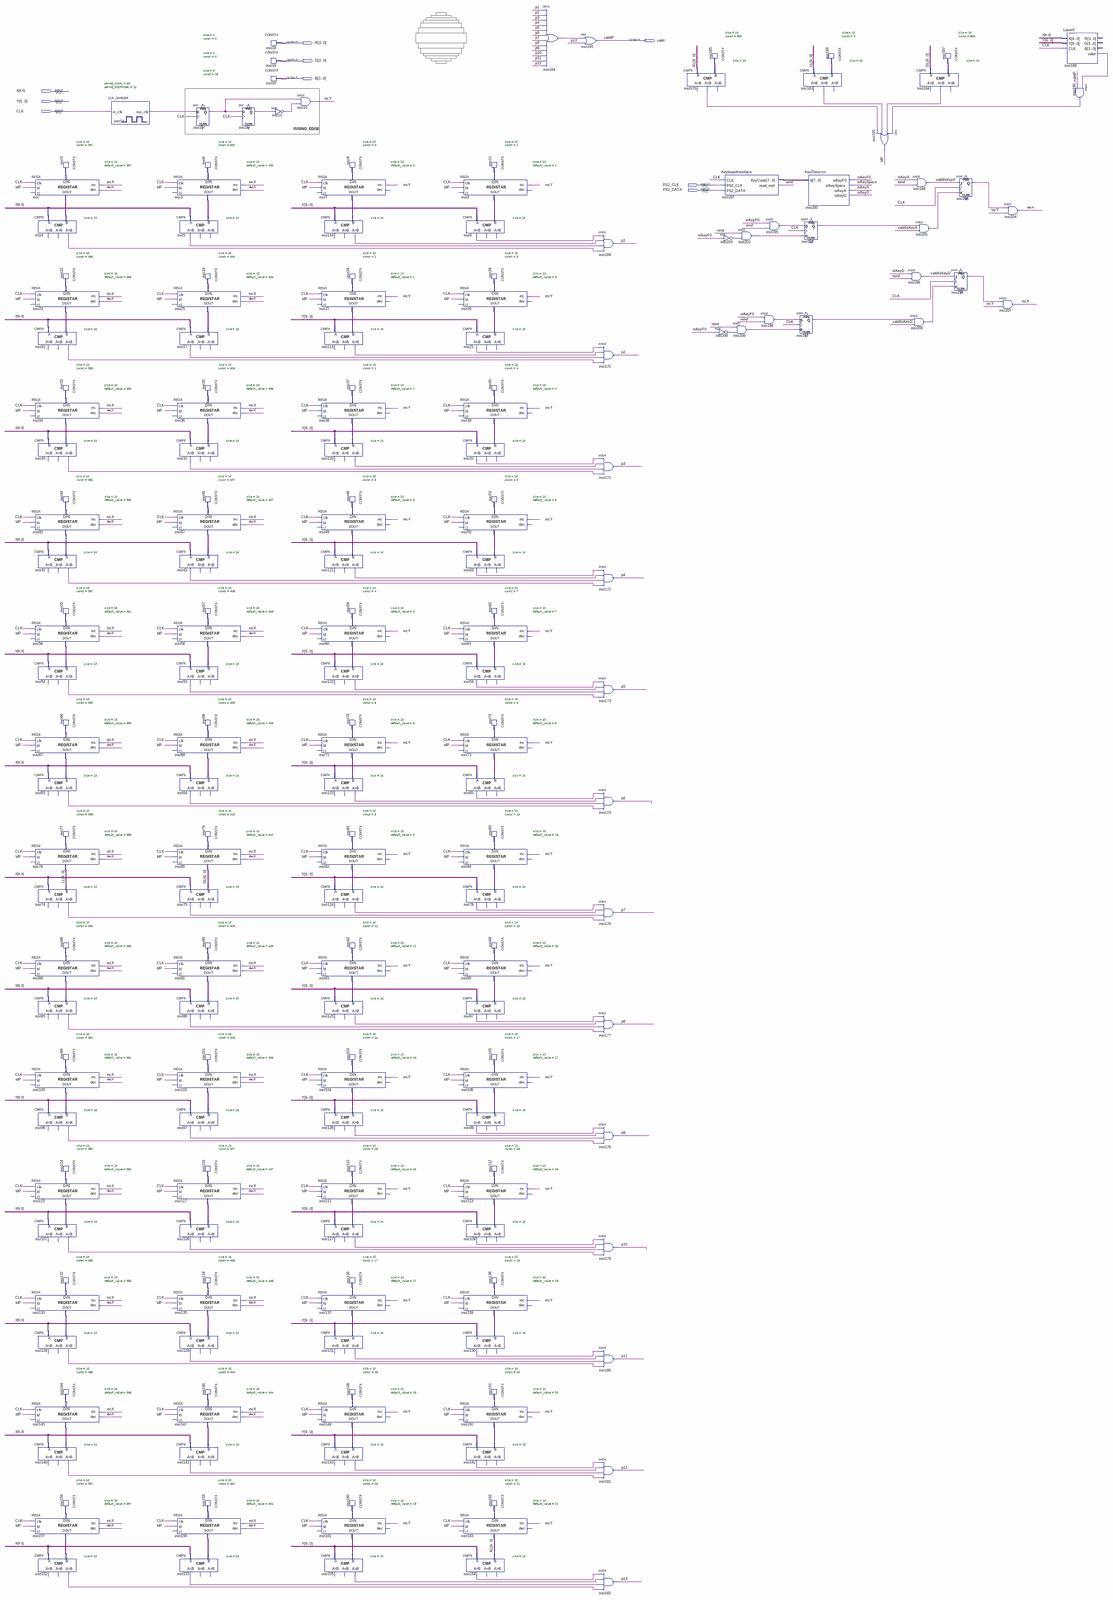
[diagram p0: schematic sheet, whole]
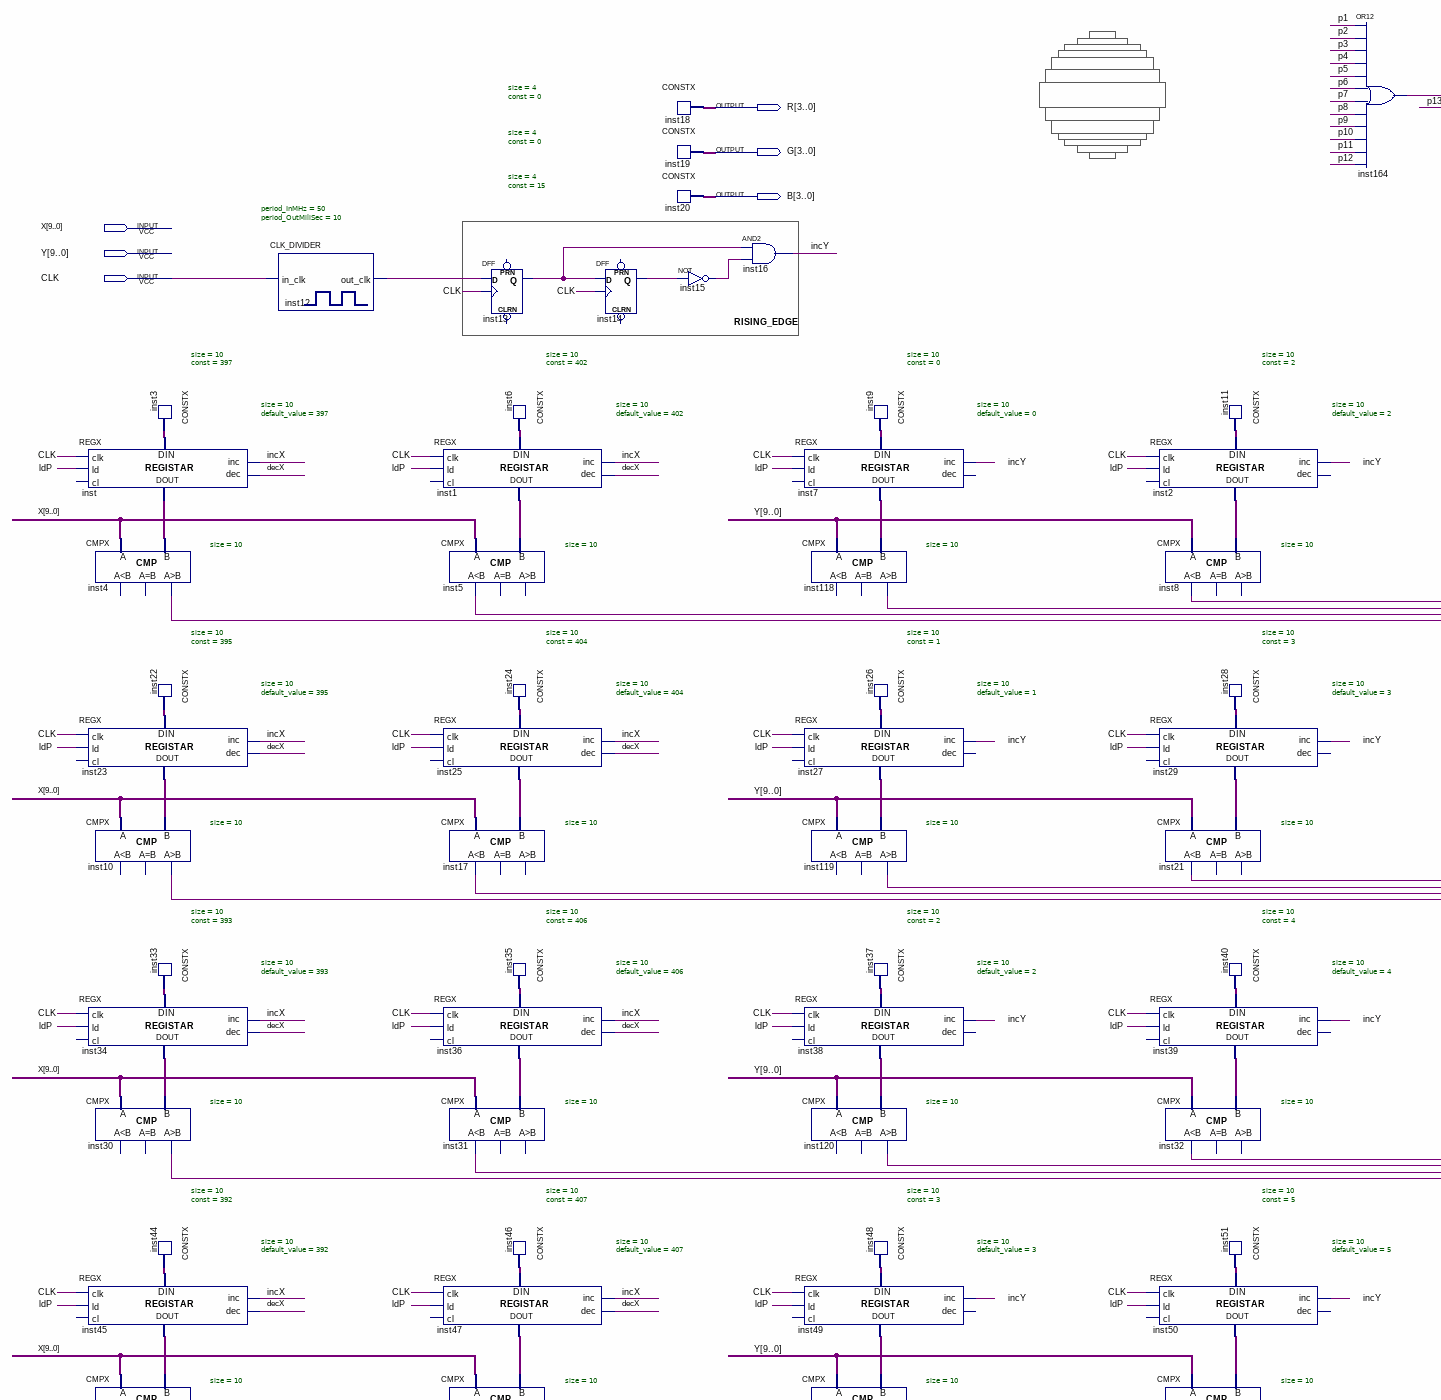
[diagram p1: schematic sheet, upper left part]
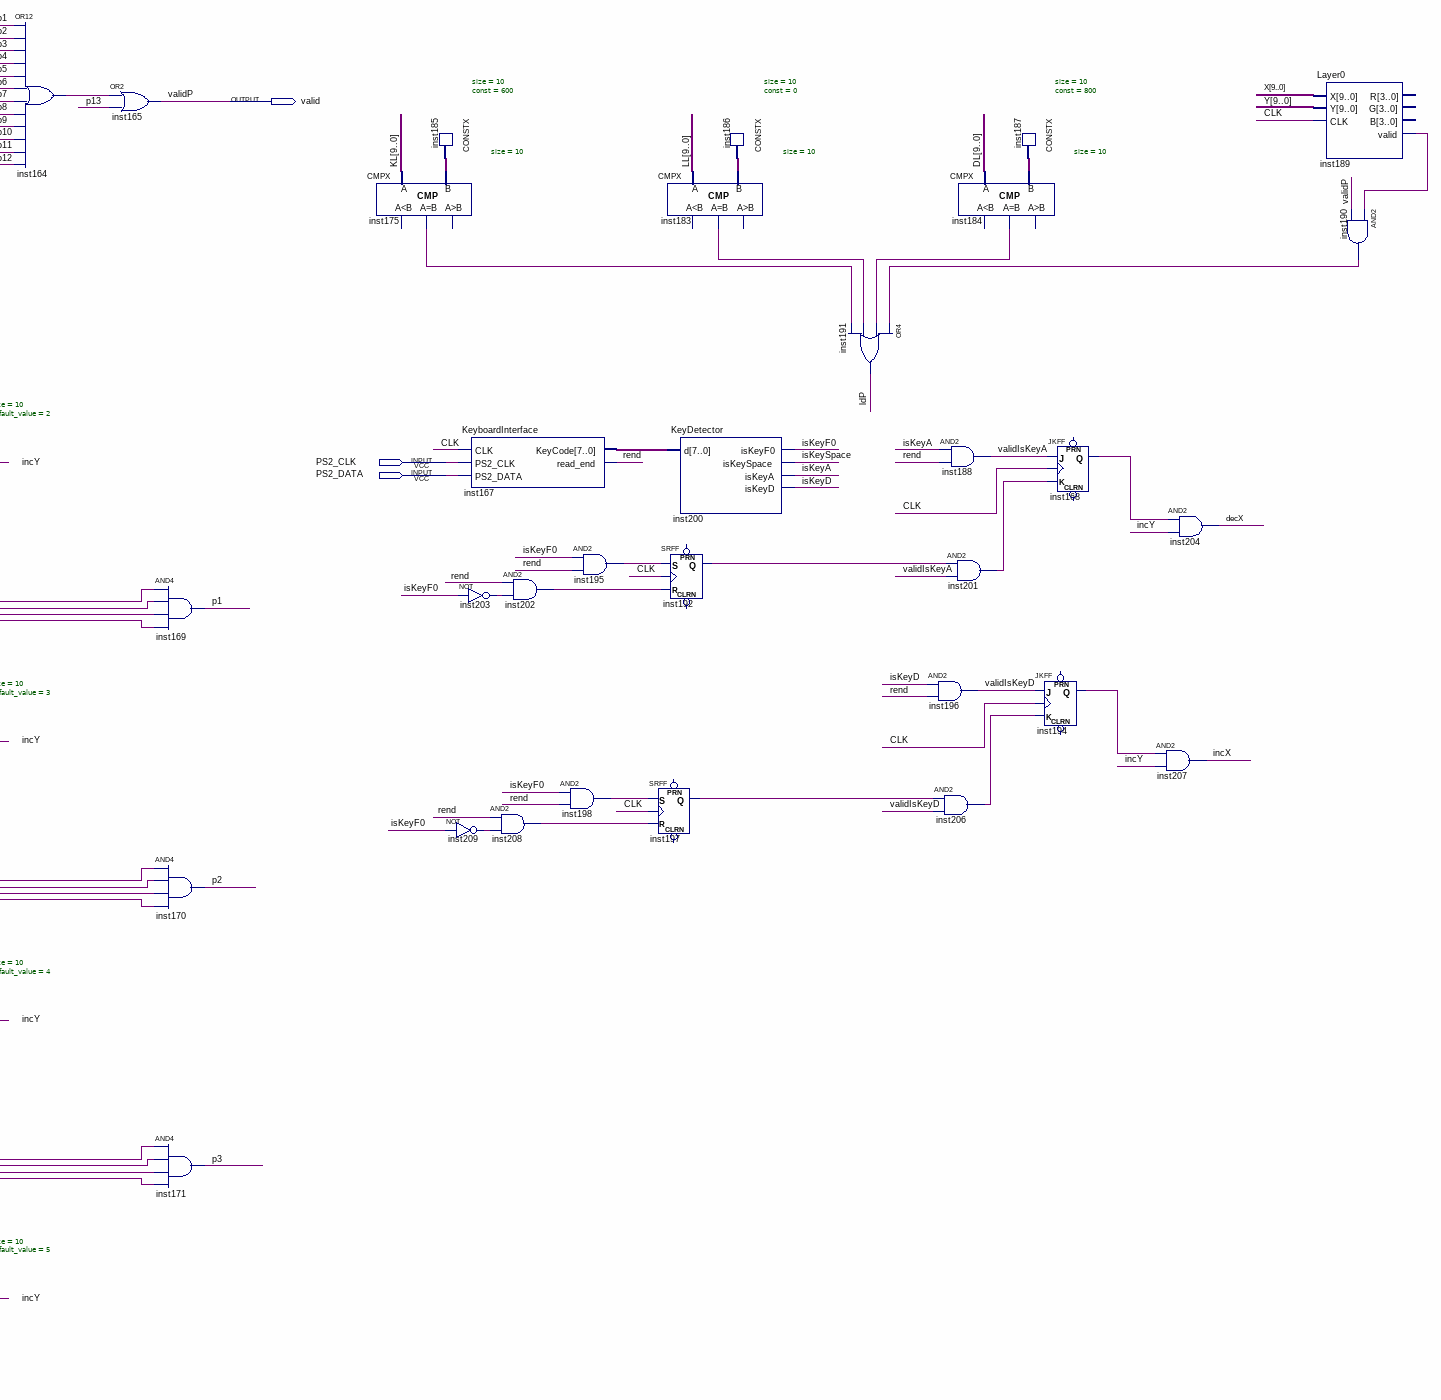
[diagram p2: schematic sheet, upper right part]
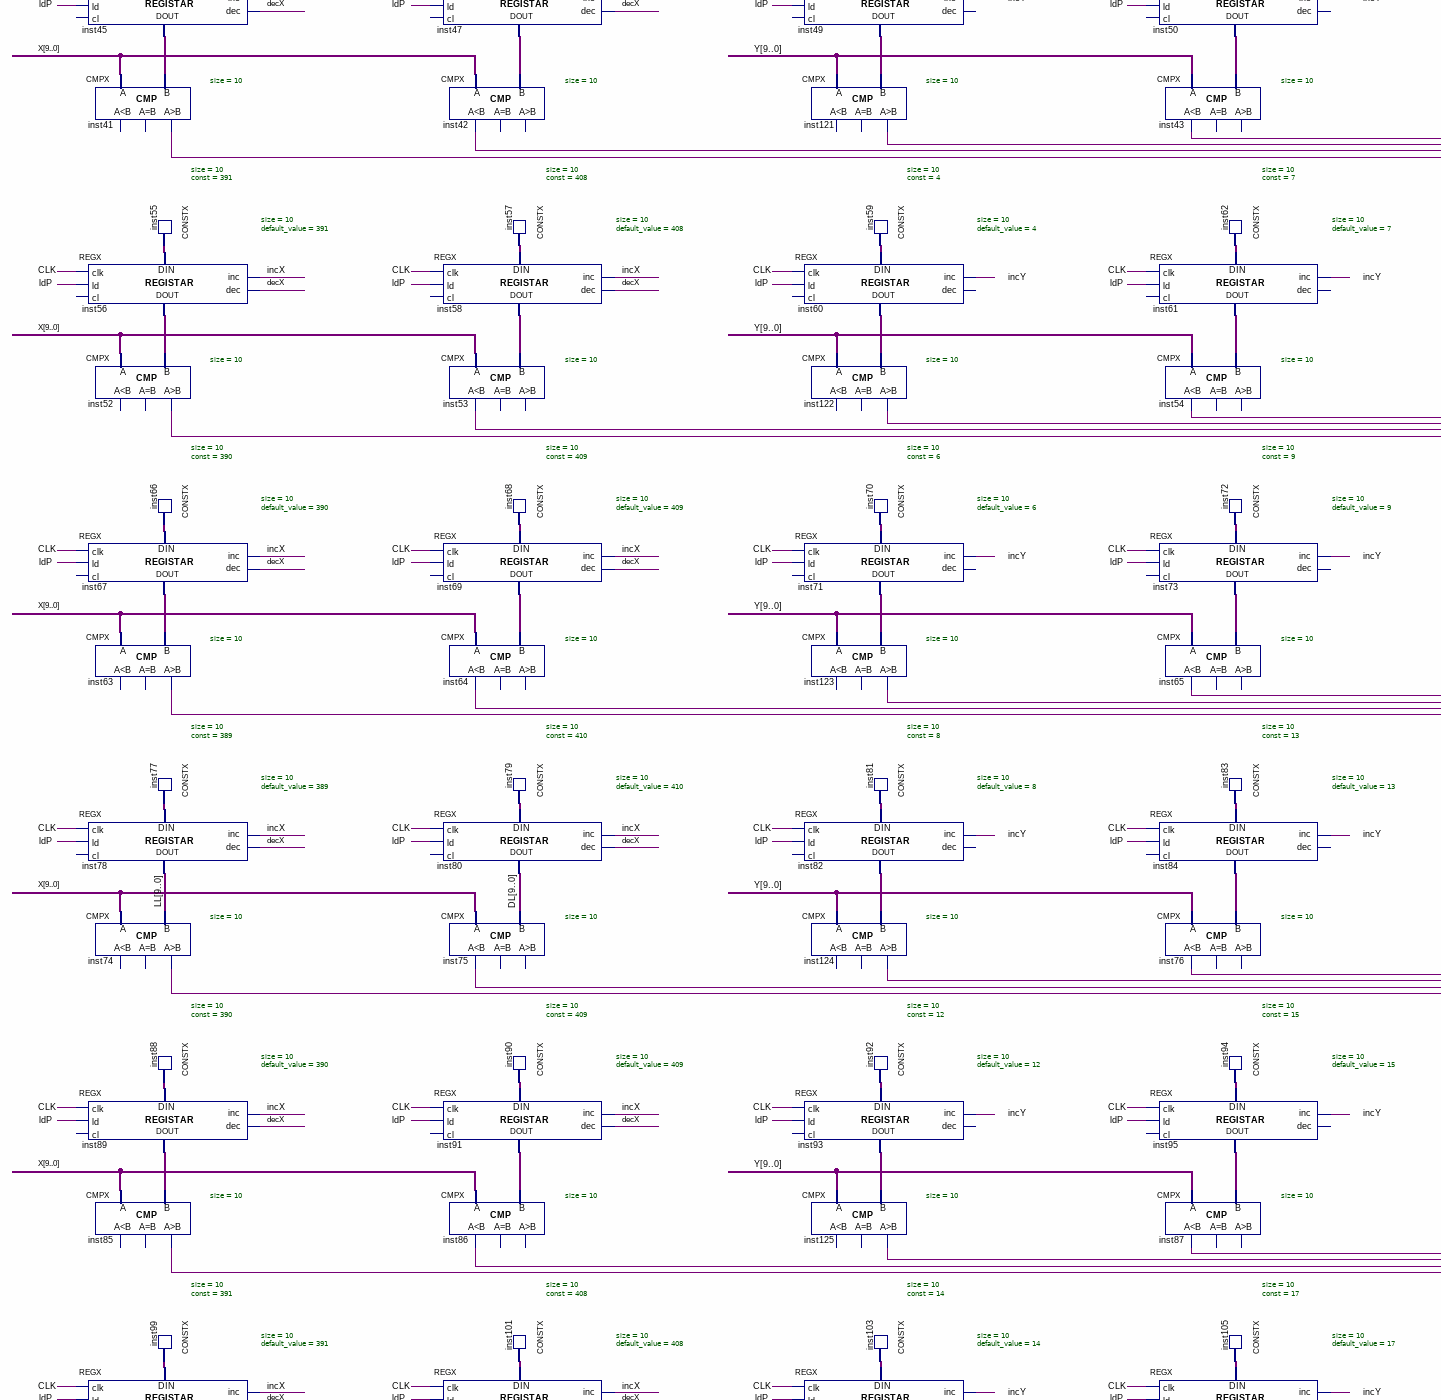
[diagram p3: schematic sheet, middle left part]
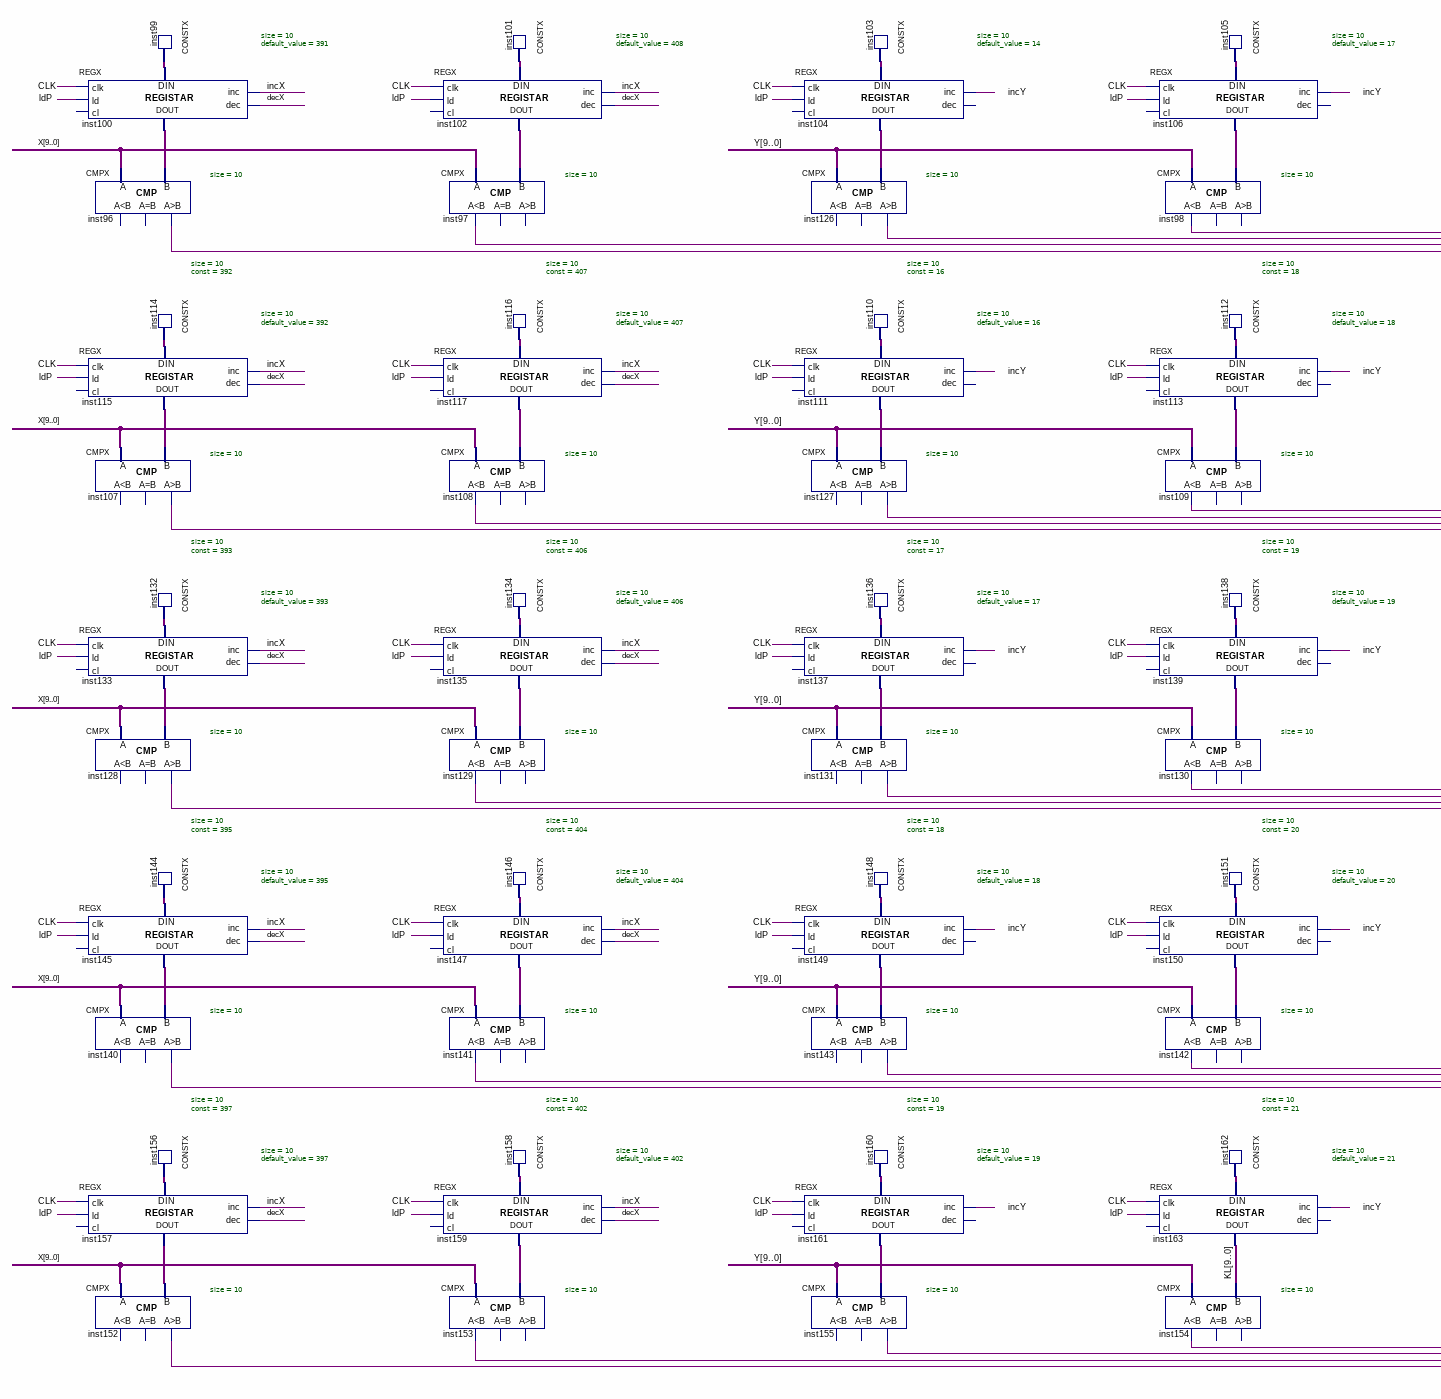
[diagram p4: schematic sheet, lower left part]
// Quartus schematic Layer1.bdf as structural Verilog: 206 symbols, 9 pins
module Layer1 (
  input  [9:0] X,
  input  [9:0] Y,
  input  CLK,
  input  PS2_CLK,
  input  PS2_DATA,
  output valid,
  output [3:0] R,
  output [3:0] G,
  output [3:0] B
);

  wire decX, incX, incY, inst4_gr, inst5_ls, inst8_ls, inst10_gr, inst12_out_clk, inst13_q, inst14_q,
       inst15_out, inst17_ls, inst21_ls, inst30_gr, inst31_ls, inst32_ls, inst41_gr, inst42_ls, inst43_ls,
       inst52_gr, inst53_ls, inst54_ls, inst63_gr, inst64_ls, inst65_ls, inst74_gr, inst75_ls, inst76_ls,
       inst85_gr, inst86_ls, inst87_ls, inst96_gr, inst97_ls, inst98_ls, inst107_gr, inst108_ls, inst109_ls,
       inst118_gr, inst119_gr, inst120_gr, inst121_gr, inst122_gr, inst123_gr, inst124_gr, inst125_gr,
       inst126_gr, inst127_gr, inst128_gr, inst129_ls, inst130_ls, inst131_gr, inst140_gr, inst141_ls,
       inst142_ls, inst143_gr, inst152_gr, inst153_ls, inst154_ls, inst155_gr, inst164_out, inst168_q,
       inst175_eq, inst183_eq, inst184_eq, inst189_valid, inst190_out, inst192_q, inst194_q, inst195_out,
       inst197_q, inst198_out, inst201_out, inst202_out, inst203_out, inst206_out, inst208_out, inst209_out,
       isKeyA, isKeyD, isKeyF0, isKeySpace, ldP, p1, p2, p3, p4, p5, p6, p7, p8, p9, p10, p11, p12, p13,
       rend, validIsKeyA, validIsKeyD;
  wire [7:0] inst167_keycode;
  wire [9:0] DL, inst1_data_out, inst2_data_out, inst3_data, inst6_data, inst7_data_out, inst9_data,
       inst11_data, inst22_data, inst23_data_out, inst24_data, inst25_data_out, inst26_data, inst27_data_out,
       inst28_data, inst29_data_out, inst33_data, inst34_data_out, inst35_data, inst36_data_out, inst37_data,
       inst38_data_out, inst39_data_out, inst40_data, inst44_data, inst45_data_out, inst46_data,
       inst47_data_out, inst48_data, inst49_data_out, inst50_data_out, inst51_data, inst55_data,
       inst56_data_out, inst57_data, inst58_data_out, inst59_data, inst60_data_out, inst61_data_out,
       inst62_data, inst66_data, inst67_data_out, inst68_data, inst69_data_out, inst70_data, inst71_data_out,
       inst72_data, inst73_data_out, inst77_data, inst79_data, inst81_data, inst82_data_out, inst83_data,
       inst84_data_out, inst88_data, inst89_data_out, inst90_data, inst91_data_out, inst92_data,
       inst93_data_out, inst94_data, inst95_data_out, inst99_data, inst100_data_out, inst101_data,
       inst102_data_out, inst103_data, inst104_data_out, inst105_data, inst106_data_out, inst110_data,
       inst111_data_out, inst112_data, inst113_data_out, inst114_data, inst115_data_out, inst116_data,
       inst117_data_out, inst132_data, inst133_data_out, inst134_data, inst135_data_out, inst136_data,
       inst137_data_out, inst138_data, inst139_data_out, inst144_data, inst145_data_out, inst146_data,
       inst147_data_out, inst148_data, inst149_data_out, inst150_data_out, inst151_data, inst156_data,
       inst157_data_out, inst158_data, inst159_data_out, inst160_data, inst161_data_out, inst162_data,
       inst185_data, inst186_data, inst187_data, inst_data_out, KL, LL;

  REGX #(.size(10), .default_value(397)) inst (
    .clk(CLK), .ld(ldP), .inc(incX), .dec(decX), .data_in(inst3_data), .data_out(inst_data_out));  // open: cl
  CMPX #(.size(10)) inst4 (.A(X), .B(inst_data_out), .gr(inst4_gr));  // open: ls, eq
  REGX #(.size(10), .default_value(395)) inst23 (
    .clk(CLK), .ld(ldP), .inc(incX), .dec(decX), .data_in(inst22_data), .data_out(inst23_data_out));  // open: cl
  CMPX #(.size(10)) inst10 (.A(X), .B(inst23_data_out), .gr(inst10_gr));  // open: ls, eq
  REGX #(.size(10), .default_value(393)) inst34 (
    .clk(CLK), .ld(ldP), .inc(incX), .dec(decX), .data_in(inst33_data), .data_out(inst34_data_out));  // open: cl
  CMPX #(.size(10)) inst30 (.A(X), .B(inst34_data_out), .gr(inst30_gr));  // open: ls, eq
  REGX #(.size(10), .default_value(392)) inst45 (
    .clk(CLK), .ld(ldP), .inc(incX), .dec(decX), .data_in(inst44_data), .data_out(inst45_data_out));  // open: cl
  CMPX #(.size(10)) inst41 (.A(X), .B(inst45_data_out), .gr(inst41_gr));  // open: ls, eq
  REGX #(.size(10), .default_value(391)) inst56 (
    .clk(CLK), .ld(ldP), .inc(incX), .dec(decX), .data_in(inst55_data), .data_out(inst56_data_out));  // open: cl
  CMPX #(.size(10)) inst52 (.A(X), .B(inst56_data_out), .gr(inst52_gr));  // open: ls, eq
  REGX #(.size(10), .default_value(390)) inst67 (
    .clk(CLK), .ld(ldP), .inc(incX), .dec(decX), .data_in(inst66_data), .data_out(inst67_data_out));  // open: cl
  CMPX #(.size(10)) inst63 (.A(X), .B(inst67_data_out), .gr(inst63_gr));  // open: ls, eq
  REGX #(.size(10), .default_value(389)) inst78 (
    .clk(CLK), .ld(ldP), .inc(incX), .dec(decX), .data_in(inst77_data), .data_out(LL));  // open: cl
  CMPX #(.size(10)) inst74 (.A(X), .B(LL), .gr(inst74_gr));  // open: ls, eq
  REGX #(.size(10), .default_value(390)) inst89 (
    .clk(CLK), .ld(ldP), .inc(incX), .dec(decX), .data_in(inst88_data), .data_out(inst89_data_out));  // open: cl
  CMPX #(.size(10)) inst85 (.A(X), .B(inst89_data_out), .gr(inst85_gr));  // open: ls, eq
  REGX #(.size(10), .default_value(391)) inst100 (
    .clk(CLK), .ld(ldP), .inc(incX), .dec(decX), .data_in(inst99_data), .data_out(inst100_data_out));  // open: cl
  CMPX #(.size(10)) inst96 (.A(X), .B(inst100_data_out), .gr(inst96_gr));  // open: ls, eq
  REGX #(.size(10), .default_value(392)) inst115 (
    .clk(CLK), .ld(ldP), .inc(incX), .dec(decX), .data_in(inst114_data), .data_out(inst115_data_out));  // open: cl
  CMPX #(.size(10)) inst107 (.A(X), .B(inst115_data_out), .gr(inst107_gr));  // open: ls, eq
  REGX #(.size(10), .default_value(393)) inst133 (
    .clk(CLK), .ld(ldP), .inc(incX), .dec(decX), .data_in(inst132_data), .data_out(inst133_data_out));  // open: cl
  CMPX #(.size(10)) inst128 (.A(X), .B(inst133_data_out), .gr(inst128_gr));  // open: ls, eq
  REGX #(.size(10), .default_value(395)) inst145 (
    .clk(CLK), .ld(ldP), .inc(incX), .dec(decX), .data_in(inst144_data), .data_out(inst145_data_out));  // open: cl
  CMPX #(.size(10)) inst140 (.A(X), .B(inst145_data_out), .gr(inst140_gr));  // open: ls, eq
  REGX #(.size(10), .default_value(397)) inst157 (
    .clk(CLK), .ld(ldP), .inc(incX), .dec(decX), .data_in(inst156_data), .data_out(inst157_data_out));  // open: cl
  CMPX #(.size(10)) inst152 (.A(X), .B(inst157_data_out), .gr(inst152_gr));  // open: ls, eq
  CONSTX #(.size(10), .\const (397)) inst3 (.data(inst3_data));
  CONSTX #(.size(10), .\const (395)) inst22 (.data(inst22_data));
  CONSTX #(.size(10), .\const (393)) inst33 (.data(inst33_data));
  CONSTX #(.size(10), .\const (392)) inst44 (.data(inst44_data));
  CONSTX #(.size(10), .\const (391)) inst55 (.data(inst55_data));
  CONSTX #(.size(10), .\const (390)) inst66 (.data(inst66_data));
  CONSTX #(.size(10), .\const (389)) inst77 (.data(inst77_data));
  CONSTX #(.size(10), .\const (390)) inst88 (.data(inst88_data));
  CONSTX #(.size(10), .\const (391)) inst99 (.data(inst99_data));
  CONSTX #(.size(10), .\const (392)) inst114 (.data(inst114_data));
  CONSTX #(.size(10), .\const (393)) inst132 (.data(inst132_data));
  CONSTX #(.size(10), .\const (395)) inst144 (.data(inst144_data));
  CONSTX #(.size(10), .\const (397)) inst156 (.data(inst156_data));
  CLK_DIVIDER #(.period_InMHz(50), .period_OutMiliSec(10)) inst12 (.in_clk(CLK), .out_clk(inst12_out_clk));
  REGX #(.size(10), .default_value(402)) inst1 (
    .clk(CLK), .ld(ldP), .inc(incX), .dec(decX), .data_in(inst6_data), .data_out(inst1_data_out));  // open: cl
  CMPX #(.size(10)) inst5 (.A(X), .B(inst1_data_out), .ls(inst5_ls));  // open: eq, gr
  REGX #(.size(10), .default_value(404)) inst25 (
    .clk(CLK), .ld(ldP), .inc(incX), .dec(decX), .data_in(inst24_data), .data_out(inst25_data_out));  // open: cl
  CMPX #(.size(10)) inst17 (.A(X), .B(inst25_data_out), .ls(inst17_ls));  // open: eq, gr
  REGX #(.size(10), .default_value(406)) inst36 (
    .clk(CLK), .ld(ldP), .inc(incX), .dec(decX), .data_in(inst35_data), .data_out(inst36_data_out));  // open: cl
  CMPX #(.size(10)) inst31 (.A(X), .B(inst36_data_out), .ls(inst31_ls));  // open: eq, gr
  REGX #(.size(10), .default_value(407)) inst47 (
    .clk(CLK), .ld(ldP), .inc(incX), .dec(decX), .data_in(inst46_data), .data_out(inst47_data_out));  // open: cl
  CMPX #(.size(10)) inst42 (.A(X), .B(inst47_data_out), .ls(inst42_ls));  // open: eq, gr
  REGX #(.size(10), .default_value(408)) inst58 (
    .clk(CLK), .ld(ldP), .inc(incX), .dec(decX), .data_in(inst57_data), .data_out(inst58_data_out));  // open: cl
  CMPX #(.size(10)) inst53 (.A(X), .B(inst58_data_out), .ls(inst53_ls));  // open: eq, gr
  REGX #(.size(10), .default_value(409)) inst69 (
    .clk(CLK), .ld(ldP), .inc(incX), .dec(decX), .data_in(inst68_data), .data_out(inst69_data_out));  // open: cl
  CMPX #(.size(10)) inst64 (.A(X), .B(inst69_data_out), .ls(inst64_ls));  // open: eq, gr
  REGX #(.size(10), .default_value(410)) inst80 (
    .clk(CLK), .ld(ldP), .inc(incX), .dec(decX), .data_in(inst79_data), .data_out(DL));  // open: cl
  CMPX #(.size(10)) inst75 (.A(X), .B(DL), .ls(inst75_ls));  // open: eq, gr
  REGX #(.size(10), .default_value(409)) inst91 (
    .clk(CLK), .ld(ldP), .inc(incX), .dec(decX), .data_in(inst90_data), .data_out(inst91_data_out));  // open: cl
  CMPX #(.size(10)) inst86 (.A(X), .B(inst91_data_out), .ls(inst86_ls));  // open: eq, gr
  REGX #(.size(10), .default_value(408)) inst102 (
    .clk(CLK), .ld(ldP), .inc(incX), .dec(decX), .data_in(inst101_data), .data_out(inst102_data_out));  // open: cl
  CMPX #(.size(10)) inst97 (.A(X), .B(inst102_data_out), .ls(inst97_ls));  // open: eq, gr
  REGX #(.size(10), .default_value(407)) inst117 (
    .clk(CLK), .ld(ldP), .inc(incX), .dec(decX), .data_in(inst116_data), .data_out(inst117_data_out));  // open: cl
  CMPX #(.size(10)) inst108 (.A(X), .B(inst117_data_out), .ls(inst108_ls));  // open: eq, gr
  REGX #(.size(10), .default_value(406)) inst135 (
    .clk(CLK), .ld(ldP), .inc(incX), .dec(decX), .data_in(inst134_data), .data_out(inst135_data_out));  // open: cl
  CMPX #(.size(10)) inst129 (.A(X), .B(inst135_data_out), .ls(inst129_ls));  // open: eq, gr
  REGX #(.size(10), .default_value(404)) inst147 (
    .clk(CLK), .ld(ldP), .inc(incX), .dec(decX), .data_in(inst146_data), .data_out(inst147_data_out));  // open: cl
  CMPX #(.size(10)) inst141 (.A(X), .B(inst147_data_out), .ls(inst141_ls));  // open: eq, gr
  REGX #(.size(10), .default_value(402)) inst159 (
    .clk(CLK), .ld(ldP), .inc(incX), .dec(decX), .data_in(inst158_data), .data_out(inst159_data_out));  // open: cl
  CMPX #(.size(10)) inst153 (.A(X), .B(inst159_data_out), .ls(inst153_ls));  // open: eq, gr
  DFF inst13 (.CLK(CLK), .D(inst12_out_clk), .Q(inst13_q));  // open: CLRN, PRN
  CONSTX #(.size(10), .\const (402)) inst6 (.data(inst6_data));
  CONSTX #(.size(10), .\const (404)) inst24 (.data(inst24_data));
  CONSTX #(.size(10), .\const (406)) inst35 (.data(inst35_data));
  CONSTX #(.size(10), .\const (407)) inst46 (.data(inst46_data));
  CONSTX #(.size(10), .\const (408)) inst57 (.data(inst57_data));
  CONSTX #(.size(10), .\const (409)) inst68 (.data(inst68_data));
  CONSTX #(.size(10), .\const (410)) inst79 (.data(inst79_data));
  CONSTX #(.size(10), .\const (409)) inst90 (.data(inst90_data));
  CONSTX #(.size(10), .\const (408)) inst101 (.data(inst101_data));
  CONSTX #(.size(10), .\const (407)) inst116 (.data(inst116_data));
  CONSTX #(.size(10), .\const (406)) inst134 (.data(inst134_data));
  CONSTX #(.size(10), .\const (404)) inst146 (.data(inst146_data));
  CONSTX #(.size(10), .\const (402)) inst158 (.data(inst158_data));
  DFF inst14 (.CLK(CLK), .D(inst13_q), .Q(inst14_q));  // open: CLRN, PRN
  CONSTX #(.size(4), .\const (0)) inst18 (.data(R));
  CONSTX #(.size(4), .\const (0)) inst19 (.data(G));
  CONSTX #(.size(4), .\const (15)) inst20 (.data(B));
  not inst15 (inst15_out, inst14_q);
  and inst16 (incY, inst13_q, inst15_out);
  REGX #(.size(10), .default_value(0)) inst7 (
    .clk(CLK), .ld(ldP), .inc(incY), .data_in(inst9_data), .data_out(inst7_data_out));  // open: cl, dec
  CMPX #(.size(10)) inst118 (.A(Y), .B(inst7_data_out), .gr(inst118_gr));  // open: ls, eq
  REGX #(.size(10), .default_value(1)) inst27 (
    .clk(CLK), .ld(ldP), .inc(incY), .data_in(inst26_data), .data_out(inst27_data_out));  // open: cl, dec
  CMPX #(.size(10)) inst119 (.A(Y), .B(inst27_data_out), .gr(inst119_gr));  // open: ls, eq
  REGX #(.size(10), .default_value(2)) inst38 (
    .clk(CLK), .ld(ldP), .inc(incY), .data_in(inst37_data), .data_out(inst38_data_out));  // open: cl, dec
  CMPX #(.size(10)) inst120 (.A(Y), .B(inst38_data_out), .gr(inst120_gr));  // open: ls, eq
  REGX #(.size(10), .default_value(3)) inst49 (
    .clk(CLK), .ld(ldP), .inc(incY), .data_in(inst48_data), .data_out(inst49_data_out));  // open: cl, dec
  CMPX #(.size(10)) inst121 (.A(Y), .B(inst49_data_out), .gr(inst121_gr));  // open: ls, eq
  REGX #(.size(10), .default_value(4)) inst60 (
    .clk(CLK), .ld(ldP), .inc(incY), .data_in(inst59_data), .data_out(inst60_data_out));  // open: cl, dec
  CMPX #(.size(10)) inst122 (.A(Y), .B(inst60_data_out), .gr(inst122_gr));  // open: ls, eq
  REGX #(.size(10), .default_value(6)) inst71 (
    .clk(CLK), .ld(ldP), .inc(incY), .data_in(inst70_data), .data_out(inst71_data_out));  // open: cl, dec
  CMPX #(.size(10)) inst123 (.A(Y), .B(inst71_data_out), .gr(inst123_gr));  // open: ls, eq
  REGX #(.size(10), .default_value(8)) inst82 (
    .clk(CLK), .ld(ldP), .inc(incY), .data_in(inst81_data), .data_out(inst82_data_out));  // open: cl, dec
  CMPX #(.size(10)) inst124 (.A(Y), .B(inst82_data_out), .gr(inst124_gr));  // open: ls, eq
  REGX #(.size(10), .default_value(12)) inst93 (
    .clk(CLK), .ld(ldP), .inc(incY), .data_in(inst92_data), .data_out(inst93_data_out));  // open: cl, dec
  CMPX #(.size(10)) inst125 (.A(Y), .B(inst93_data_out), .gr(inst125_gr));  // open: ls, eq
  REGX #(.size(10), .default_value(14)) inst104 (
    .clk(CLK), .ld(ldP), .inc(incY), .data_in(inst103_data), .data_out(inst104_data_out));  // open: cl, dec
  CMPX #(.size(10)) inst126 (.A(Y), .B(inst104_data_out), .gr(inst126_gr));  // open: ls, eq
  REGX #(.size(10), .default_value(16)) inst111 (
    .clk(CLK), .ld(ldP), .inc(incY), .data_in(inst110_data), .data_out(inst111_data_out));  // open: cl, dec
  CMPX #(.size(10)) inst127 (.A(Y), .B(inst111_data_out), .gr(inst127_gr));  // open: ls, eq
  REGX #(.size(10), .default_value(17)) inst137 (
    .clk(CLK), .ld(ldP), .inc(incY), .data_in(inst136_data), .data_out(inst137_data_out));  // open: cl, dec
  CMPX #(.size(10)) inst131 (.A(Y), .B(inst137_data_out), .gr(inst131_gr));  // open: ls, eq
  REGX #(.size(10), .default_value(18)) inst149 (
    .clk(CLK), .ld(ldP), .inc(incY), .data_in(inst148_data), .data_out(inst149_data_out));  // open: cl, dec
  CMPX #(.size(10)) inst143 (.A(Y), .B(inst149_data_out), .gr(inst143_gr));  // open: ls, eq
  REGX #(.size(10), .default_value(19)) inst161 (
    .clk(CLK), .ld(ldP), .inc(incY), .data_in(inst160_data), .data_out(inst161_data_out));  // open: cl, dec
  CMPX #(.size(10)) inst155 (.A(Y), .B(inst161_data_out), .gr(inst155_gr));  // open: ls, eq
  CONSTX #(.size(10), .\const (0)) inst9 (.data(inst9_data));
  CONSTX #(.size(10), .\const (1)) inst26 (.data(inst26_data));
  CONSTX #(.size(10), .\const (2)) inst37 (.data(inst37_data));
  CONSTX #(.size(10), .\const (3)) inst48 (.data(inst48_data));
  CONSTX #(.size(10), .\const (4)) inst59 (.data(inst59_data));
  CONSTX #(.size(10), .\const (6)) inst70 (.data(inst70_data));
  CONSTX #(.size(10), .\const (8)) inst81 (.data(inst81_data));
  CONSTX #(.size(10), .\const (12)) inst92 (.data(inst92_data));
  CONSTX #(.size(10), .\const (14)) inst103 (.data(inst103_data));
  CONSTX #(.size(10), .\const (16)) inst110 (.data(inst110_data));
  CONSTX #(.size(10), .\const (17)) inst136 (.data(inst136_data));
  CONSTX #(.size(10), .\const (18)) inst148 (.data(inst148_data));
  CONSTX #(.size(10), .\const (19)) inst160 (.data(inst160_data));
  REGX #(.size(10), .default_value(2)) inst2 (
    .clk(CLK), .ld(ldP), .inc(incY), .data_in(inst11_data), .data_out(inst2_data_out));  // open: cl, dec
  CMPX #(.size(10)) inst8 (.A(Y), .B(inst2_data_out), .ls(inst8_ls));  // open: eq, gr
  REGX #(.size(10), .default_value(3)) inst29 (
    .clk(CLK), .ld(ldP), .inc(incY), .data_in(inst28_data), .data_out(inst29_data_out));  // open: cl, dec
  CMPX #(.size(10)) inst21 (.A(Y), .B(inst29_data_out), .ls(inst21_ls));  // open: eq, gr
  REGX #(.size(10), .default_value(4)) inst39 (
    .clk(CLK), .ld(ldP), .inc(incY), .data_in(inst40_data), .data_out(inst39_data_out));  // open: cl, dec
  CMPX #(.size(10)) inst32 (.A(Y), .B(inst39_data_out), .ls(inst32_ls));  // open: eq, gr
  REGX #(.size(10), .default_value(5)) inst50 (
    .clk(CLK), .ld(ldP), .inc(incY), .data_in(inst51_data), .data_out(inst50_data_out));  // open: cl, dec
  CMPX #(.size(10)) inst43 (.A(Y), .B(inst50_data_out), .ls(inst43_ls));  // open: eq, gr
  REGX #(.size(10), .default_value(7)) inst61 (
    .clk(CLK), .ld(ldP), .inc(incY), .data_in(inst62_data), .data_out(inst61_data_out));  // open: cl, dec
  CMPX #(.size(10)) inst54 (.A(Y), .B(inst61_data_out), .ls(inst54_ls));  // open: eq, gr
  REGX #(.size(10), .default_value(9)) inst73 (
    .clk(CLK), .ld(ldP), .inc(incY), .data_in(inst72_data), .data_out(inst73_data_out));  // open: cl, dec
  CMPX #(.size(10)) inst65 (.A(Y), .B(inst73_data_out), .ls(inst65_ls));  // open: eq, gr
  REGX #(.size(10), .default_value(13)) inst84 (
    .clk(CLK), .ld(ldP), .inc(incY), .data_in(inst83_data), .data_out(inst84_data_out));  // open: cl, dec
  CMPX #(.size(10)) inst76 (.A(Y), .B(inst84_data_out), .ls(inst76_ls));  // open: eq, gr
  REGX #(.size(10), .default_value(15)) inst95 (
    .clk(CLK), .ld(ldP), .inc(incY), .data_in(inst94_data), .data_out(inst95_data_out));  // open: cl, dec
  CMPX #(.size(10)) inst87 (.A(Y), .B(inst95_data_out), .ls(inst87_ls));  // open: eq, gr
  REGX #(.size(10), .default_value(17)) inst106 (
    .clk(CLK), .ld(ldP), .inc(incY), .data_in(inst105_data), .data_out(inst106_data_out));  // open: cl, dec
  CMPX #(.size(10)) inst98 (.A(Y), .B(inst106_data_out), .ls(inst98_ls));  // open: eq, gr
  REGX #(.size(10), .default_value(18)) inst113 (
    .clk(CLK), .ld(ldP), .inc(incY), .data_in(inst112_data), .data_out(inst113_data_out));  // open: cl, dec
  CMPX #(.size(10)) inst109 (.A(Y), .B(inst113_data_out), .ls(inst109_ls));  // open: eq, gr
  REGX #(.size(10), .default_value(19)) inst139 (
    .clk(CLK), .ld(ldP), .inc(incY), .data_in(inst138_data), .data_out(inst139_data_out));  // open: cl, dec
  CMPX #(.size(10)) inst130 (.A(Y), .B(inst139_data_out), .ls(inst130_ls));  // open: eq, gr
  REGX #(.size(10), .default_value(20)) inst150 (
    .clk(CLK), .ld(ldP), .inc(incY), .data_in(inst151_data), .data_out(inst150_data_out));  // open: cl, dec
  CMPX #(.size(10)) inst142 (.A(Y), .B(inst150_data_out), .ls(inst142_ls));  // open: eq, gr
  REGX #(.size(10), .default_value(21)) inst163 (
    .clk(CLK), .ld(ldP), .inc(incY), .data_in(inst162_data), .data_out(KL));  // open: cl, dec
  CMPX #(.size(10)) inst154 (.A(Y), .B(KL), .ls(inst154_ls));  // open: eq, gr
  CONSTX #(.size(10), .\const (2)) inst11 (.data(inst11_data));
  CONSTX #(.size(10), .\const (3)) inst28 (.data(inst28_data));
  CONSTX #(.size(10), .\const (4)) inst40 (.data(inst40_data));
  CONSTX #(.size(10), .\const (5)) inst51 (.data(inst51_data));
  CONSTX #(.size(10), .\const (7)) inst62 (.data(inst62_data));
  CONSTX #(.size(10), .\const (9)) inst72 (.data(inst72_data));
  CONSTX #(.size(10), .\const (13)) inst83 (.data(inst83_data));
  CONSTX #(.size(10), .\const (15)) inst94 (.data(inst94_data));
  CONSTX #(.size(10), .\const (17)) inst105 (.data(inst105_data));
  CONSTX #(.size(10), .\const (18)) inst112 (.data(inst112_data));
  CONSTX #(.size(10), .\const (19)) inst138 (.data(inst138_data));
  CONSTX #(.size(10), .\const (20)) inst151 (.data(inst151_data));
  CONSTX #(.size(10), .\const (21)) inst162 (.data(inst162_data));
  or inst164 (inst164_out, p1, p2, p3, p4, p5, p6, p7, p8, p9, p10, p11, p12);
  or inst165 (valid, inst164_out, p13);
  and inst169 (p1, inst8_ls, inst118_gr, inst5_ls, inst4_gr);
  and inst170 (p2, inst21_ls, inst119_gr, inst17_ls, inst10_gr);
  and inst171 (p3, inst32_ls, inst120_gr, inst31_ls, inst30_gr);
  and inst172 (p4, inst43_ls, inst121_gr, inst42_ls, inst41_gr);
  and inst173 (p5, inst54_ls, inst122_gr, inst53_ls, inst52_gr);
  and inst174 (p6, inst65_ls, inst123_gr, inst64_ls, inst63_gr);
  and inst176 (p7, inst76_ls, inst124_gr, inst75_ls, inst74_gr);
  and inst177 (p8, inst87_ls, inst125_gr, inst86_ls, inst85_gr);
  and inst178 (p9, inst98_ls, inst126_gr, inst97_ls, inst96_gr);
  and inst179 (p10, inst109_ls, inst127_gr, inst108_ls, inst107_gr);
  and inst180 (p11, inst130_ls, inst131_gr, inst129_ls, inst128_gr);
  and inst181 (p12, inst142_ls, inst143_gr, inst141_ls, inst140_gr);
  and inst182 (p13, inst154_ls, inst155_gr, inst153_ls, inst152_gr);
  CMPX #(.size(10)) inst175 (.A(KL), .B(inst185_data), .eq(inst175_eq));  // open: ls, gr
  CONSTX #(.size(10), .\const (600)) inst185 (.data(inst185_data));
  KeyboardInterface inst167 (
    .CLK(CLK), .PS2_CLK(PS2_CLK), .PS2_DATA(PS2_DATA), .KeyCode(inst167_keycode), .read_end(rend));
  not inst203 (inst203_out, isKeyF0);
  and inst208 (inst208_out, rend, inst209_out);
  not inst209 (inst209_out, isKeyF0);
  and inst202 (inst202_out, rend, inst203_out);
  and inst195 (inst195_out, isKeyF0, rend);
  and inst198 (inst198_out, isKeyF0, rend);
  CMPX #(.size(10)) inst183 (.A(LL), .B(inst186_data), .eq(inst183_eq));  // open: ls, gr
  KeyDetector inst200 (
    .d(inst167_keycode), .isKeyF0(isKeyF0), .isKeySpace(isKeySpace), .isKeyA(isKeyA), .isKeyD(isKeyD));
  SRFF inst192 (.S(inst195_out), .R(inst202_out), .CLK(CLK), .Q(inst192_q));  // open: PRN, CLRN
  SRFF inst197 (.S(inst198_out), .R(inst208_out), .CLK(CLK), .Q(inst197_q));  // open: PRN, CLRN
  CONSTX #(.size(10), .\const (0)) inst186 (.data(inst186_data));
  or inst191 (ldP, inst190_out, inst184_eq, inst183_eq, inst175_eq);
  CMPX #(.size(10)) inst184 (.A(DL), .B(inst187_data), .eq(inst184_eq));  // open: ls, gr
  and inst188 (validIsKeyA, isKeyA, rend);
  and inst201 (inst201_out, inst192_q, validIsKeyA);
  and inst196 (validIsKeyD, isKeyD, rend);
  and inst206 (inst206_out, inst197_q, validIsKeyD);
  CONSTX #(.size(10), .\const (800)) inst187 (.data(inst187_data));
  JKFF inst168 (.K(inst201_out), .J(validIsKeyA), .CLK(CLK), .Q(inst168_q));  // open: PRN, CLRN
  JKFF inst194 (.K(inst206_out), .J(validIsKeyD), .CLK(CLK), .Q(inst194_q));  // open: PRN, CLRN
  and inst204 (decX, inst168_q, incY);
  and inst207 (incX, inst194_q, incY);
  Layer0 inst189 (.X(X), .Y(Y), .CLK(CLK), .valid(inst189_valid));  // open: R, G, B
  and inst190 (inst190_out, inst189_valid, valid);

  // Other names for the same wires on the sheet: validP = valid

  // Notes on the sheet:
  //   RISING_EDGE
endmodule
